# EAGLE schematic POVBase (EAGLE 9.4.2)
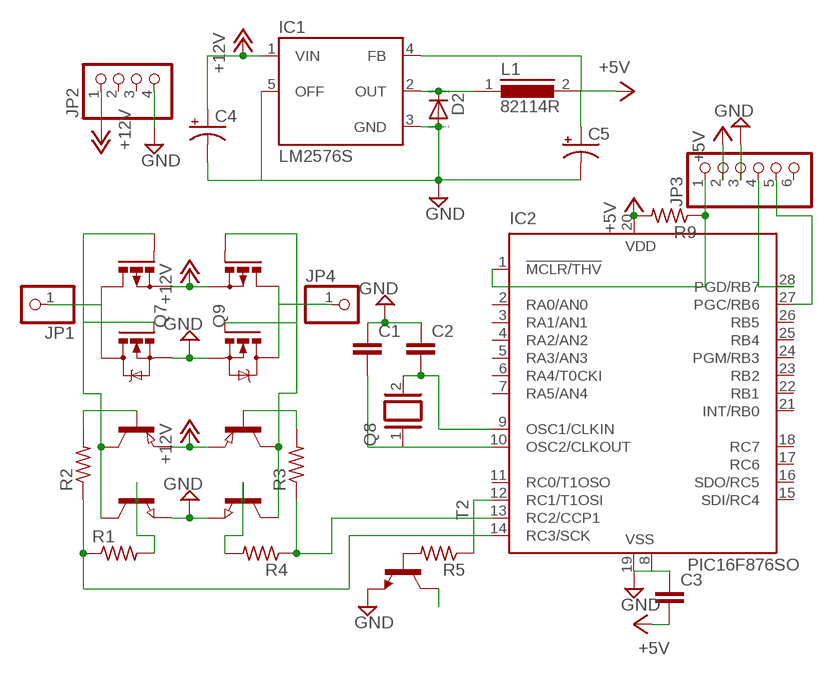
[diagram p0: schematic, sheet 1]

## Parts
C1  C-EUC0805  [C0805]
C2  C-EUC0805  [C0805]
C3  C-EUC0805  [C0805]
C4  CPOL-USE2.5-7  [E2,5-7]
C5  CPOL-USE1.8-4  [E1,8-4]
D2  DIODE_E-SMC  [DIODE_SMC]
IC1  LM2576S  [TO263-5]
IC2  PIC16F876SO  [SO28W]
JP1  PINHD-1X1  [1X01]
JP2  PINHD-1X4  [1X04]
JP3  PINHD-1X6  [1X06]
JP4  PINHD-1X1  [1X01]
L1  82114R  [82114R]
Q1  NPN-TRANSISTOR_SOT23  [SOT23]
Q2  NPN-TRANSISTOR_SOT23  [SOT23]
Q3  PNP-TRANSISTOR_SOT23  [SOT23]
Q4  PNP-TRANSISTOR_SOT23  [SOT23]
Q5  IRF540  [TO220BV]
Q6  IRF540  [TO220BV]
Q7  PMOSFET_PTO220BV  [TO220BV]
Q8  XTAL/S  [QS]
Q9  PMOSFET_PTO220BV  [TO220BV]
R1  R-US_R0805  [R0805]
R2  R-US_R0805  [R0805]
R3  R-US_R0805  [R0805]
R4  R-US_R0805  [R0805]
R5  R-US_R0805  [R0805]
R9  R-US_R0805  [R0805]
T2  2SC1306  [TO220BV]

## Nets
+5V: C3.2 C5.+ IC1.4(FB) IC2.20(VDD) JP3.2 L1.2 R9.2
+12V: C4.+ IC1.1(VIN) JP2.1 Q3.2(E) Q4.2(E) Q7.S Q9.S
GND: C1.1 C2.1 C3.1 C4.- C5.- D2.A(C) IC1.3(GND) IC1.5(OFF) IC2.8(VSS) IC2.19(VSS) JP2.4 JP3.3 Q1.2(E) Q2.2(E) Q5.S Q6.S T2.3(E)
N$1: Q1.3(C) Q3.3(C) Q5.G Q7.G
N$2: Q1.1(B) R1.2
N$3: Q2.1(B) R4.2
N$4: Q2.3(C) Q4.3(C) Q6.G Q9.G
N$5: Q3.1(B) R2.2
N$6: Q4.1(B) R3.2
N$7: IC2.14(RC3/SCK) R1.1 R2.1
N$8: IC2.13(RC2/CCP1) R3.1 R4.1
N$10: JP4.1 Q6.D Q9.D
N$11: JP1.1 Q5.D Q7.D
N$12: IC2.1(!MCLR/THV) JP3.1 R9.1
N$13: IC2.28(PGD/RB7) JP3.4
N$14: IC2.27(PGC/RB6) JP3.5
N$15: D2.C(A) IC1.2(OUT) L1.1
N$16: C1.2 IC2.10(OSC2/CLKOUT) Q8.1
N$17: C2.2 IC2.9(OSC1/CLKIN) Q8.2
N$20: T2.2(C)
N$21: IC2.12(RC1/T1OSI) R5.1
N$22: R5.2 T2.1(B)
Unconnected: IC2.2(RA0/AN0) IC2.3(RA1/AN1) IC2.4(RA2/AN2) IC2.5(RA3/AN3) IC2.6(RA4/T0CKI) IC2.7(RA5/AN4) IC2.11(RC0/T1OSO) IC2.15(SDI/RC4) IC2.16(SDO/RC5) IC2.17(RC6) IC2.18(RC7) IC2.21(INT/RB0) IC2.22(RB1) IC2.23(RB2) IC2.24(PGM/RB3) IC2.25(RB4) IC2.26(RB5) JP2.2 JP2.3 JP3.6

## Library data of the parts
C1-C3 = resistor:C-EU: CAPACITOR, European symbol
C4 C5 = rcl:CPOL-US: POLARIZED CAPACITOR, American symbol; SPICEPREFIX: C
D2 = eagle-ltspice:DIODE_E-: Schottky Diode; SPICEMODEL: diode; SPICEPREFIX: D
IC1 = lm2576:LM2576: National Semiconductor <http://www.national.com> 3.0A "Simple Switcher"(c) 52kHz, Vout 1.23-37V (HV: 57V), Vin 40V (HV: 60V), 50µA standby current
IC2 = microchip:PIC16*876: MICROCONTROLLER flash type; MF: MICROCHIP; MPN: PIC16F876-20/SO; OC_FARNELL: 9761268; OC_NEWARK: 12C1950
JP1 JP4 = pinhead:PINHD-1X1: PIN HEADER
JP2 = pinhead:PINHD-1X4: PIN HEADER
JP3 = pinhead:PINHD-1X6: PIN HEADER
L1 = inductors:82114R: INDUCTOR; SPICEPREFIX: L
Q1 Q2 = semicon-smd-ipc:NPN-TRANSISTOR_: NPN TRANSISTOR
Q3 Q4 = semicon-smd-ipc:PNP-TRANSISTOR_: PNP TRANSISTOR
Q5 Q6 = transistor-power:IRF540: HEXFET Power MOSFET
Q7 Q9 = transistor-power:PMOSFET_P: Power MOSFET P-Channel
Q8 = special:XTAL/S: CRYSTAL
R1-R5 R9 = resistor:R-US_: RESISTOR, American symbol
T2 = transistor:2SC1306: NPN Transistor Final RF Power Outupt Source: 2sc1306.pdf